# Altium project F103RCT6主控板.PrjPcb
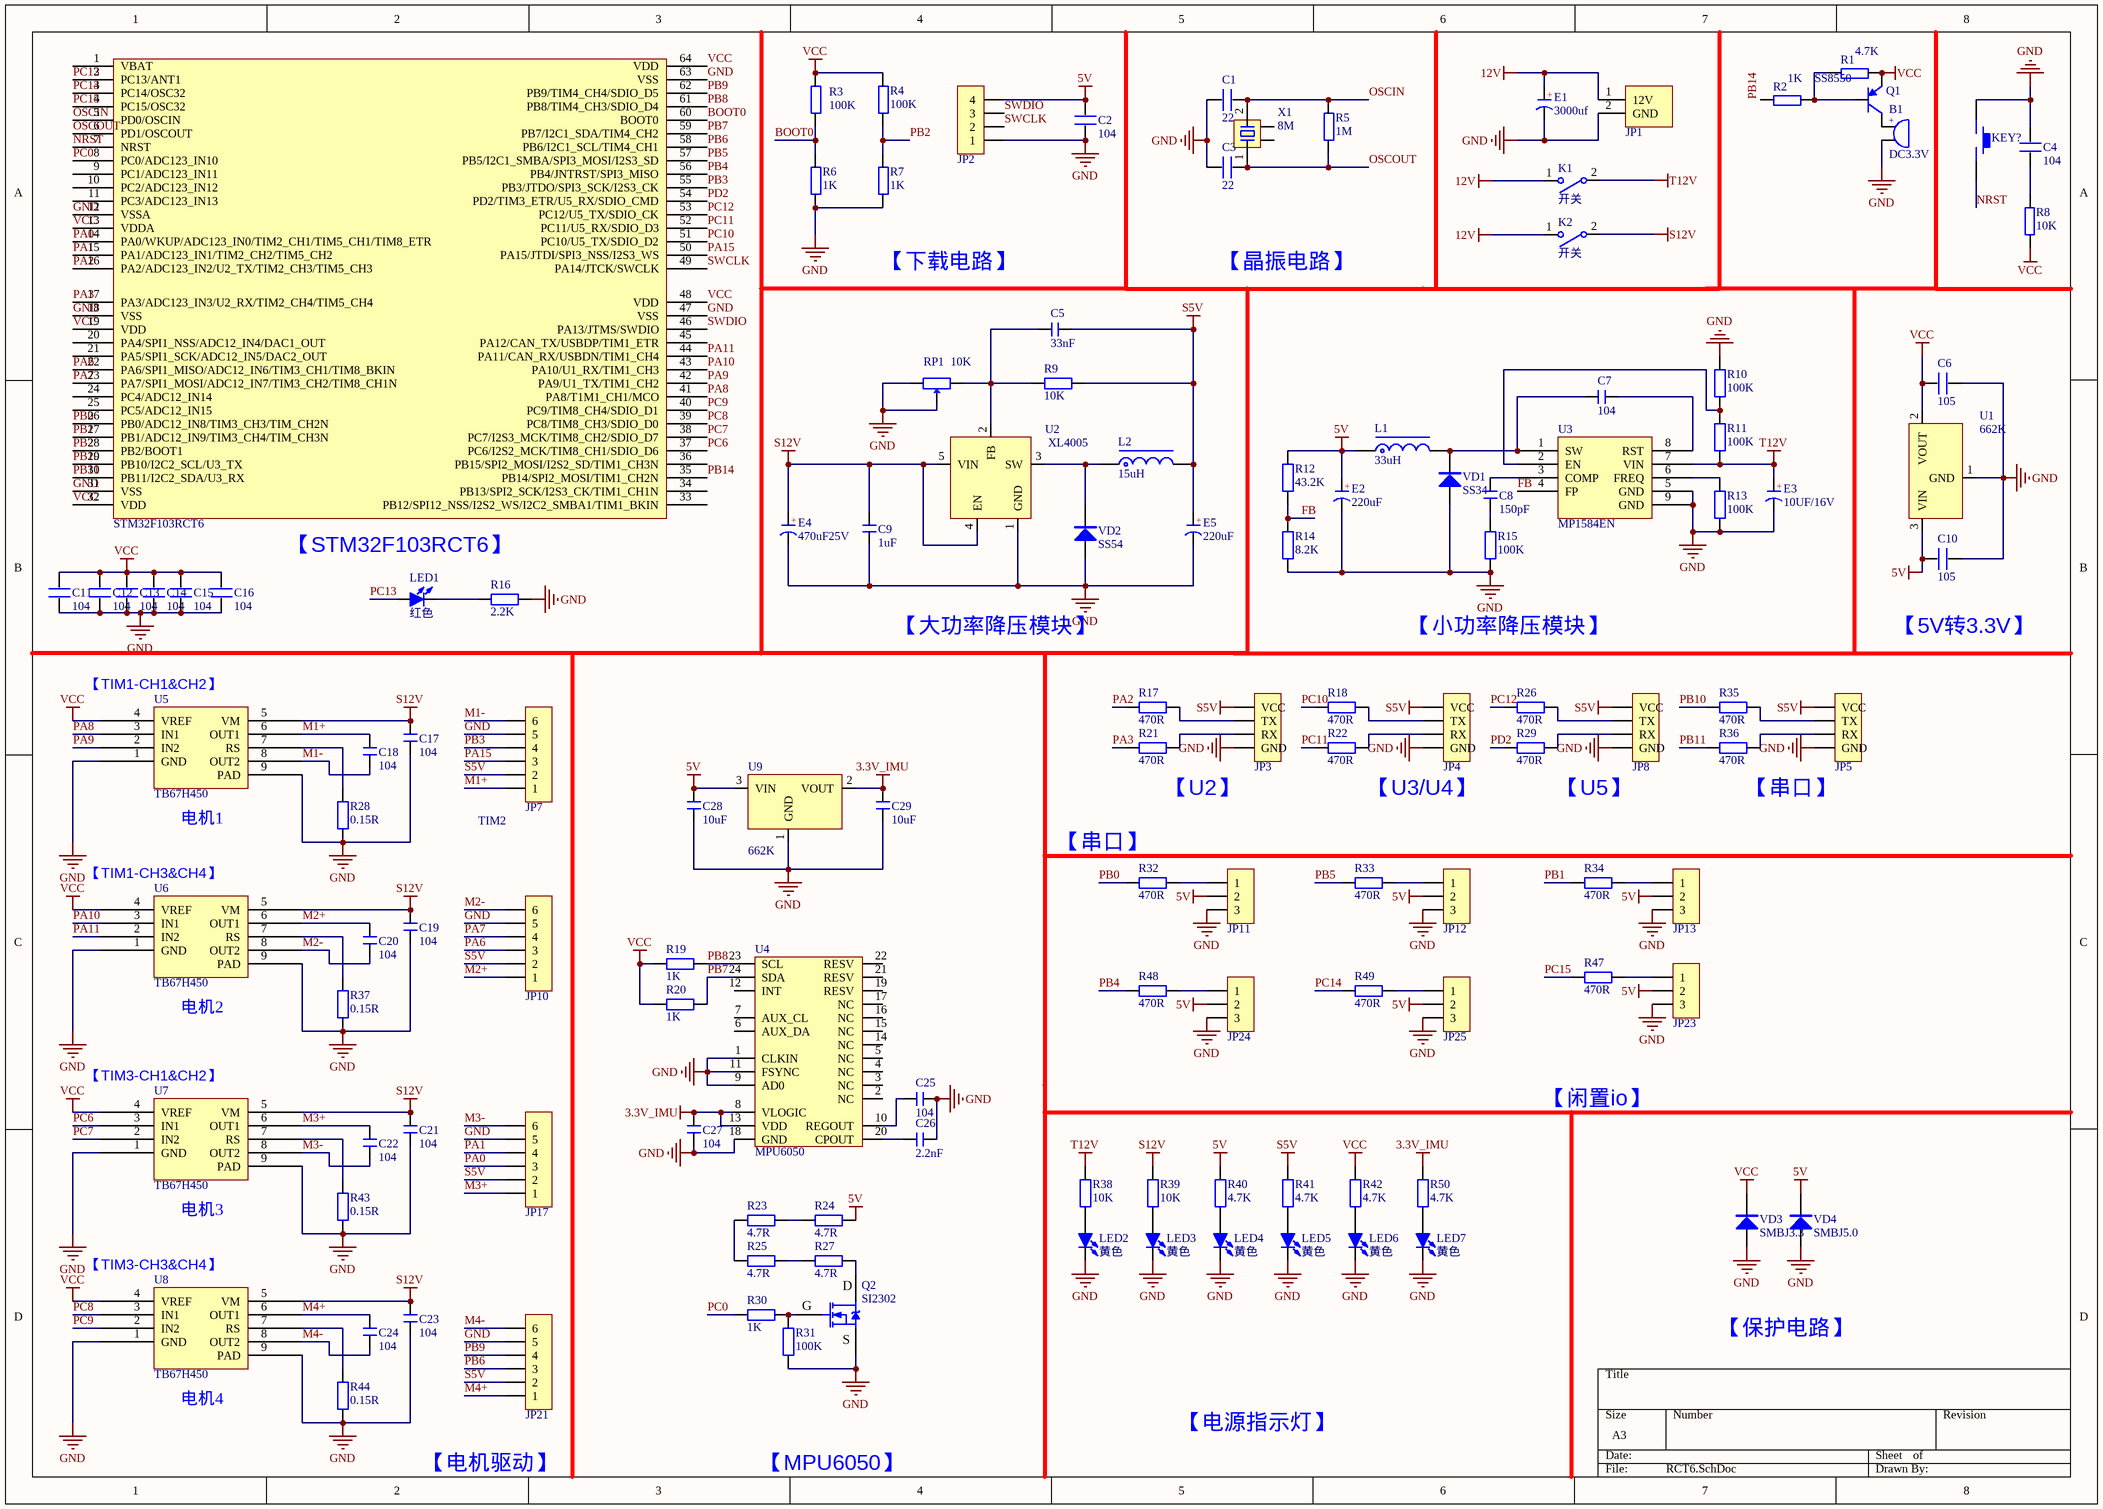
[diagram p0: RCT6.SchDoc]
1 sheet, 129 parts. Net scope: global (net labels, ports and power ports of the same name join across sheets).
Board file: F103RCT6.PcbDoc

## Sheet RCT6.SchDoc
size A3

### Parts
B1  DC3.3V  [BEEP 5x9x5.5]
C1  22  [C 0603_L]
C2  104  [C 0603_L]
C3  22  [C 0603_L]
C4  104  [C 0603_L]
C5  33nF  [C 0603_L]
C6  105  [C 0603_L]
C7  104  [C 0603_L]
C8  150pF  [C 0603_L]
C9  1uF  [C 0603_L]
C10  105  [C 0603_L]
C11  104  [C 0603_L]
C12  104  [C 0603_L]
C13  104  [C 0603_L]
C14  104  [C 0603_L]
C15  104  [C 0603_L]
C16  104  [C 0603_L]
C17  104  [C 0603_L]
C18  104  [C 0603_L]
C19  104  [C 0603_L]
C20  104  [C 0603_L]
C21  104  [C 0603_L]
C22  104  [C 0603_L]
C23  104  [C 0603_L]
C24  104  [C 0603_L]
C25  104  [C 0603]
C26  2.2nF  [C 0603]
C27  104  [C 0603]
C28  10uF  [C 0805]
C29  10uF  [C 0805]
E1  3000uf  [CAP 5.0*10*20]
E2  220uF  [CD D(7343)]
E3  10UF/16V  [CAP 2.5*6.3*7-H]
E4  470uF25V  [CAP 5.0*10*20]
E5  220uF  [CD D(7343)]
JP1  HDR-1X2  [XT60]  (value not drawn)
JP2  HDR-1X4  [XH2.54-LI-4P]  (value not drawn)
JP3  HDR-1X4  [XH2.54-4P]  (value not drawn)
JP4  HDR-1X4  [XH2.54-4P]  (value not drawn)
JP5  HDR-1X4  [XH2.54-4P]  (value not drawn)
JP7  HDR-1X6  [XH2.54-6P_H]  (value not drawn)
JP8  HDR-1X4  [XH2.54-4P]  (value not drawn)
JP10  HDR-1X6  [XH2.54-6P_H]  (value not drawn)
JP11  HDR-1X3  [HDR-1X3]  (value not drawn)
JP12  HDR-1X3  [HDR-1X3]  (value not drawn)
JP13  HDR-1X3  [HDR-1X3]  (value not drawn)
JP17  HDR-1X6  [XH2.54-6P_H]  (value not drawn)
JP21  HDR-1X6  [XH2.54-6P_H]  (value not drawn)
JP23  HDR-1X3  [HDR-1X3]  (value not drawn)
JP24  HDR-1X3  [HDR-1X3]  (value not drawn)
JP25  HDR-1X3  [HDR-1X3]  (value not drawn)
K1  开关  [开关]
K2  开关  [开关]
KEY?  KEY_M  [TSW DIP-3*6*4.3]  (value not drawn)
L1  33uH  [CDRH74]
L2  15uH  [CD104]
LED1  红色  [LED 0603B]
LED2  黄色  [LED 0805R]
LED3  黄色  [LED 0805R]
LED4  黄色  [LED 0805R]
LED5  黄色  [LED 0805R]
LED6  黄色  [LED 0805R]
LED7  黄色  [LED 0805R]
Q1  SS8550  [SOT23-3N]
Q2  SI2302  [SOT23-3N]
R1  4.7K  [R 0603]
R2  1K  [R 0603]
R3  100K  [R 0603]
R4  100K  [R 0603]
R5  1M  [R 0603]
R6  1K  [R 0603]
R7  1K  [R 0603]
R8  10K  [R 0603]
R9  10K  [R 0603]
R10  100K  [R 0603]
R11  100K  [R 0603]
R12  43.2K  [R 0603]
R13  100K  [R 0603]
R14  8.2K  [R 0603]
R15  100K  [R 0603]
R16  2.2K  [R 0603]
R17  470R  [R 0603]
R18  470R  [R 0603]
R19  1K  [R 0603]
R20  1K  [R 0603]
R21  470R  [R 0603]
R22  470R  [R 0603]
R23  4.7R  [R 0805]
R24  4.7R  [R 0805]
R25  4.7R  [R 0805]
R26  470R  [R 0603]
R27  4.7R  [R 0805]
R28  0.15R  [R 0805]
R29  470R  [R 0603]
R30  1K  [R 0603]
R31  100K  [R 0603]
R32  470R  [R 0603]
R33  470R  [R 0603]
R34  470R  [R 0603]
R35  470R  [R 0603]
R36  470R  [R 0603]
R37  0.15R  [R 0805]
R38  10K  [R 0603]
R39  10K  [R 0603]
R40  4.7K  [R 0603]
R41  4.7K  [R 0603]
R42  4.7K  [R 0603]
R43  0.15R  [R 0805]
R44  0.15R  [R 0805]
R47  470R  [R 0603]
R48  470R  [R 0603]
R49  470R  [R 0603]
R50  4.7K  [R 0603]
RP1  10K  [3362P]
STM32F103RCT6  STM32F103rct6  [LQFP64 10x10_L]  (value not drawn)
U1  662K  [SOT23-3L]
U2  XL4005  [TO263-5A]
U3  MP1584EN  [SOP8_N - duplicate]
U4  MPU6050  [QFN24]
U5  TB67H450  [SOP8_N - duplicate]
U6  TB67H450  [SOP8_N - duplicate]
U7  TB67H450  [SOP8_N - duplicate]
U8  TB67H450  [SOP8_N - duplicate]
U9  662K  [SOT23-3N]
VD1  SS34  [SMA]
VD2  SS54  [SMA]
VD3  SMBJ3.3  [SMA]
VD4  SMBJ5.0  [SMA]
X1  8M  [XTAL-49S DIP]

### Nets
3.3V_IMU: C27.2 C29.2 R50.2 U4.8(VLOGIC) U4.13(VDD) U9.2(VOUT)
5V: C2.1 C10.2 C28.2 E2.1(A) JP2.4 JP11.2 JP12.2 JP13.2 JP23.2 JP24.2 JP25.2 L1.1 R12.2 R24.2 R40.2 U1.3(VIN) U9.3(VIN) VD4.2(K)
12V: E1.1(A) JP1.1(12V) K1.1 K2.1
GND: B1.2 C1.2 C2.2 C3.2 C4.2 C6.1 C9.1 C10.1 C11.2 C12.2 C13.2 C14.2 C15.2 C16.2 C17.1 C19.1 C21.1 C23.1 C25.1 C26.1 C27.1 C28.1 C29.1 E1.2(K) E2.2(K) E3.2(K) E4.2(K) E5.2(K) JP1.2(GND) JP2.1 JP3.4(GND) JP4.4(GND) JP5.4(GND) JP7.5 JP8.4(GND) JP10.5 JP11.3 JP12.3 JP13.3 JP17.5 JP21.5 JP23.3 JP24.3 JP25.3 KEY?.1 LED2.2(K) LED3.2(K) LED4.2(K) LED5.2(K) LED6.2(K) LED7.2(K) Q2.2(S) R6.1 R7.1 R10.2 R13.1 R14.1 R15.1 R16.1 R28.1 R31.1 R37.1 R43.1 R44.1 RP1.2 RP1.3 STM32F103RCT6.12(VSSA) STM32F103RCT6.18(VSS) STM32F103RCT6.31(VSS) STM32F103RCT6.47(VSS) STM32F103RCT6.63(VSS) U1.1(GND) U2.1(GND) U3.5(GND) U3.9(GND) U4.1(CLKIN) U4.9(AD0) U4.11(FSYNC) U4.18(GND) U5.1(GND) U5.9(PAD) U6.1(GND) U6.9(PAD) U7.1(GND) U7.9(PAD) U8.1(GND) U8.9(PAD) U9.1(GND) VD1.1(A) VD2.1(A) VD3.1(A) VD4.1(A)
S5V: C5.2 E5.1(A) JP3.1(VCC) JP4.1(VCC) JP5.1(VCC) JP7.2 JP8.1(VCC) JP10.2 JP17.2 JP21.2 L2.2 R9.2 R41.2
S12V: C9.2 C17.2 C19.2 C21.2 C23.2 E4.1(A) K2.2 R39.2 U2.4(EN) U2.5(VIN) U5.5(VM) U6.5(VM) U7.5(VM) U8.5(VM)
T12V: E3.1(A) K1.2 R11.1 R38.2 U3.7(VIN)
VCC: C6.2 C11.1 C12.1 C13.1 C14.1 C15.1 C16.1 Q1.2(E) R1.2 R3.2 R4.2 R8.2 R19.1 R20.1 R42.2 STM32F103RCT6.13(VDDA) STM32F103RCT6.19(VDD) STM32F103RCT6.32(VDD) STM32F103RCT6.48(VDD) STM32F103RCT6.64(VDD) U1.2(VOUT) U5.4(VREF) U6.4(VREF) U7.4(VREF) U8.4(VREF) VD3.2(K)
BOOT0: R3.1 R6.2 STM32F103RCT6.60(BOOT0)
FB: R12.1 R14.2 U3.4(FP)
M1+: C18.2 JP7.1 U5.6(OUT1)
M1-: C18.1 JP7.6 U5.8(OUT2)
M2+: C20.2 JP10.1 U6.6(OUT1)
M2-: C20.1 JP10.6 U6.8(OUT2)
M3+: C22.2 JP17.1 U7.6(OUT1)
M3-: C22.1 JP17.6 U7.8(OUT2)
M4+: C24.2 JP21.1 U8.6(OUT1)
M4-: C24.1 JP21.6 U8.8(OUT2)
NRST: KEY?.2 STM32F103RCT6.7(NRST)
OSCIN: C1.1 R5.2 STM32F103RCT6.5(PD0/OSCIN) X1.2
OSCOUT: C3.1 R5.1 STM32F103RCT6.6(PD1/OSCOUT) X1.1
PA0: JP17.3 STM32F103RCT6.14(PA0/WKUP/ADC123_IN0/TIM2_CH1/TIM5_CH1/TIM8_ETR)
PA1: JP17.4 STM32F103RCT6.15(PA1/ADC123_IN1/TIM2_CH2/TIM5_CH2)
PA2: R17.1 STM32F103RCT6.16(PA2/ADC123_IN2/U2_TX/TIM2_CH3/TIM5_CH3)
PA3: R21.1 STM32F103RCT6.17(PA3/ADC123_IN3/U2_RX/TIM2_CH4/TIM5_CH4)
PA6: JP10.3 STM32F103RCT6.22(PA6/SPI1_MISO/ADC12_IN6/TIM3_CH1/TIM8_BKIN)
PA7: JP10.4 STM32F103RCT6.23(PA7/SPI1_MOSI/ADC12_IN7/TIM3_CH2/TIM8_CH1N)
PA8: STM32F103RCT6.41(PA8/T1M1_CH1/MCO) U5.3(IN1)
PA9: STM32F103RCT6.42(PA9/U1_TX/TIM1_CH2) U5.2(IN2)
PA10: STM32F103RCT6.43(PA10/U1_RX/TIM1_CH3) U6.3(IN1)
PA11: STM32F103RCT6.44(PA11/CAN_RX/USBDN/TIM1_CH4) U6.2(IN2)
PA15: JP7.3 STM32F103RCT6.50(PA15/JTDI/SPI3_NSS/I2S3_WS)
PB0: R32.1 STM32F103RCT6.26(PB0/ADC12_IN8/TIM3_CH3/TIM_CH2N)
PB1: R34.1 STM32F103RCT6.27(PB1/ADC12_IN9/TIM3_CH4/TIM_CH3N)
PB2: R4.1 R7.2 STM32F103RCT6.28(PB2/BOOT1)
PB3: JP7.4 STM32F103RCT6.55(PB3/JTDO/SPI3_SCK/I2S3_CK)
PB4: R48.1 STM32F103RCT6.56(PB4/JNTRST/SPI3_MISO)
PB5: R33.1 STM32F103RCT6.57(PB5/I2C1_SMBA/SPI3_MOSI/I2S3_SD)
PB6: JP21.3 STM32F103RCT6.58(PB6/I2C1_SCL/TIM4_CH1)
PB7: R20.2 STM32F103RCT6.59(PB7/I2C1_SDA/TIM4_CH2) U4.24(SDA)
PB8: R19.2 STM32F103RCT6.61(PB8/TIM4_CH3/SDIO_D4) U4.23(SCL)
PB9: JP21.4 STM32F103RCT6.62(PB9/TIM4_CH4/SDIO_D5)
PB10: R35.1 STM32F103RCT6.29(PB10/I2C2_SCL/U3_TX)
PB11: R36.1 STM32F103RCT6.30(PB11/I2C2_SDA/U3_RX)
PB14: R2.1 STM32F103RCT6.35(PB14/SPI2_MOSI/TIM1_CH2N)
PC0: R30.1 STM32F103RCT6.8(PC0/ADC123_IN10)
PC6: STM32F103RCT6.37(PC6/I2S2_MCK/TIM8_CH1/SDIO_D6) U7.3(IN1)
PC7: STM32F103RCT6.38(PC7/I2S3_MCK/TIM8_CH2/SDIO_D7) U7.2(IN2)
PC8: STM32F103RCT6.39(PC8/TIM8_CH3/SDIO_D0) U8.3(IN1)
PC9: STM32F103RCT6.40(PC9/TIM8_CH4/SDIO_D1) U8.2(IN2)
PC10: R18.1 STM32F103RCT6.51(PC10/U5_TX/SDIO_D2)
PC11: R22.1 STM32F103RCT6.52(PC11/U5_RX/SDIO_D3)
PC12: R26.1 STM32F103RCT6.53(PC12/U5_TX/SDIO_CK)
PC13: LED1.1(A) STM32F103RCT6.2(PC13/ANT1)
PC14: R49.1 STM32F103RCT6.3(PC14/OSC32)
PC15: R47.1 STM32F103RCT6.4(PC15/OSC32)
PD2: R29.1 STM32F103RCT6.54(PD2/TIM3_ETR/U5_RX/SDIO_CMD)
SWCLK: JP2.2 STM32F103RCT6.49(PA14/JTCK/SWCLK)
SWDIO: JP2.3 STM32F103RCT6.46(PA13/JTMS/SWDIO)
NetB1_1: B1.1 Q1.3(C)
NetC4_1: C4.1 R8.1
NetC5_1: C5.1 R9.1 RP1.1 U2.2(FB)
NetC7_1: C7.1 L1.2 U3.1(SW) VD1.2(K)
NetC7_2: C7.2 U3.8(RST)
NetC8_1: C8.1 R15.2
NetC8_2: C8.2 U3.3(COMP)
NetC25_2: C25.2 U4.10(REGOUT)
NetC26_2: C26.2 U4.20(CPOUT)
NetJP3_2: JP3.2(TX) R17.2
NetJP3_3: JP3.3(RX) R21.2
NetJP4_2: JP4.2(TX) R18.2
NetJP4_3: JP4.3(RX) R22.2
NetJP5_2: JP5.2(TX) R35.2
NetJP5_3: JP5.3(RX) R36.2
NetJP8_2: JP8.2(TX) R26.2
NetJP8_3: JP8.3(RX) R29.2
NetJP11_1: JP11.1 R32.2
NetJP12_1: JP12.1 R33.2
NetJP13_1: JP13.1 R34.2
NetJP23_1: JP23.1 R47.2
NetJP24_1: JP24.1 R48.2
NetJP25_1: JP25.1 R49.2
NetL2_1: L2.1 U2.3(SW) VD2.2(K)
NetLED1_2: LED1.2(K) R16.2
NetLED2_1: LED2.1(A) R38.1
NetLED3_1: LED3.1(A) R39.1
NetLED4_1: LED4.1(A) R40.1
NetLED5_1: LED5.1(A) R41.1
NetLED6_1: LED6.1(A) R42.1
NetLED7_1: LED7.1(A) R50.1
NetQ1_1: Q1.1(B) R1.1 R2.2
NetQ2_1: Q2.1(G) R30.2 R31.2
NetQ2_3: Q2.3(D) R27.2
NetR10_1: R10.1 R11.2 U3.2(EN)
NetR13_2: R13.2 U3.6(FREQ)
NetR23_1: R23.1 R25.1
NetR23_2: R23.2 R24.1
NetR25_2: R25.2 R27.1
NetR28_2: R28.2 U5.7(RS)
NetR37_2: R37.2 U6.7(RS)
NetR43_2: R43.2 U7.7(RS)
NetR44_2: R44.2 U8.7(RS)

Not connected (* = marked no-connect by the designer): STM32F103RCT6 1(VBAT) 9(PC1/ADC123_IN11) 10(PC2/ADC123_IN12) 11(PC3/ADC123_IN13) 20(PA4/SPI1_NSS/ADC12_IN4/DAC1_OUT) 21(PA5/SPI1_SCK/ADC12_IN5/DAC2_OUT) 24(PC4/ADC12_IN14) 25(PC5/ADC12_IN15) 33(PB12/SPI12_NSS/I2S2_WS/I2C2_SMBA1/TIM1_BKIN) 34(PB13/SPI2_SCK/I2S3_CK/TIM1_CH1N) 36(PB15/SPI2_MOSI/I2S2_SD/TIM1_CH3N) 45(PA12/CAN_TX/USBDP/TIM1_ETR); U4 2(NC) 3(NC) 4(NC) 5(NC) 6(AUX_DA) 7(AUX_CL) 12(INT) 14(NC) 15(NC) 16(NC) 17(NC) 19(RESV) 21(RESV) 22(RESV); X1 3(2) 4

### Notes on the sheet
- 【下载电路】
- 【晶振电路】
- 【STM32F103RCT6】
- 【大功率降压模块】
- 【小功率降压模块】
- 【5V转3.3V】
- (near U5) 【TIM1-CH1&CH2】
- (near U5) 电机1
- (near JP7) TIM2
- (near R32) 【串口】
- (near R21) 【U2】
- 【U3/U4】
- 【U5】
- (near R36) 【串口】
- (near U6) 【TIM1-CH3&CH4】
- (near U6) 电机2
- (near U7) 【TIM3-CH1&CH2】
- 【闲置io】
- (near U7) 电机3
- (near U8) 【TIM3-CH3&CH4】
- 【保护电路】
- (near U8) 电机4
- 【电源指示灯】
- 【电机驱动】
- 【MPU6050】
- (in symbol BEEP) +
- (in symbol C-CAP) +
- (in symbol C-CD) +

### Library data of the parts
B1 = BEEP: 蜂鸣器; 版权归属: 源创客; BOM名称: 蜂鸣器; 学习资源: www.ooocke.com
C1-C4 C6 C10-C16 = C
C5 C7-C9 C17-C29 = C: 无极性贴片电容; 版权归属: 源创客; BOM名称: 无极性贴片电容; 学习资源: www.ooocke.com
E1 E3 E4 = C-CAP: 直插电解电容; 版权归属: 源创客; BOM名称: 直插电解电容; 学习资源: www.ooocke.com
E2 E5 = C-CD: 贴片钽电容; 版权归属: 源创客; BOM名称: 贴片钽电容; 学习资源: www.ooocke.com
JP1 = Header 2: 2P接插件; 版权归属: 源创客; BOM名称: 2P接插件; 学习资源: www.ooocke.com
JP2-JP5 JP8 = Header 4: 4P接插件; 版权归属: 源创客; BOM名称: 4P接插件; 学习资源: www.ooocke.com
JP7 JP10 JP17 JP21 = Header 6: 6P接插件; 版权归属: 源创客; BOM名称: 6P接插件; 学习资源: www.ooocke.com
JP11-JP13 JP23-JP25 = Header 3: 3P接插件; 版权归属: 源创客; BOM名称: 3P接插件; 学习资源: www.ooocke.com
L1 = L-CDRH: 功率屏蔽电感; 版权归属: 源创客; BOM名称: 功率屏蔽电感; 学习资源: www.ooocke.com
L2 = L-CD: 贴片功率电感; BOM名称: 功率电感; 版权归属: 源创客; 学习资源: www.ooocke.com
LED1-LED7 = LED-SMD: 贴片LED; 版权归属: 源创客; BOM名称: 贴片LED; 学习资源: www.ooocke.com
Q1 = 8550-SMD: 高频放大-PNP型; 版权归属: 源创客; 属性: 40V 1.5A 1W 100MHZ; BOM名称: 高频放大-PNP型; 学习资源: www.ooocke.com
Q2 = SI2302: N沟道场效应管; 版权归属: 源创客; BOM名称: N沟道场效应管; 学习资源: www.ooocke.com
R1-R8 = R
R9-R44 R47-R50 = R: 贴片电阻; 版权归属: 源创客; BOM名称: 贴片电阻; 学习资源: www.ooocke.com
RP1 = RP-ID: 插件单联电位器; BOM名称: 插件电位器; 版权归属: 源创客; 学习资源: www.ooocke.com
STM32F103RCT6 = STM32F103rct6: FLash：256K   RAM:48K   IO:64
U3 = MP1584EN: 电源芯片
U4 = MPU6050: 9轴运动处理传感器
U5-U8 = TB67H450: 电机驱动芯片
U9 = 662K: LDO
VD1-VD4 = SS14: 肖特基二极管; 版权归属: 源创客; 属性: 40V/1A; BOM名称: 肖特基二极管; 学习资源: www.ooocke.com
X1 = XTAL-4: 4脚晶振; 版权归属: 源创客; BOM名称: 4脚晶振; 学习资源: www.ooocke.com